# Altium schematic sheet Sweep.SchDoc
size A4
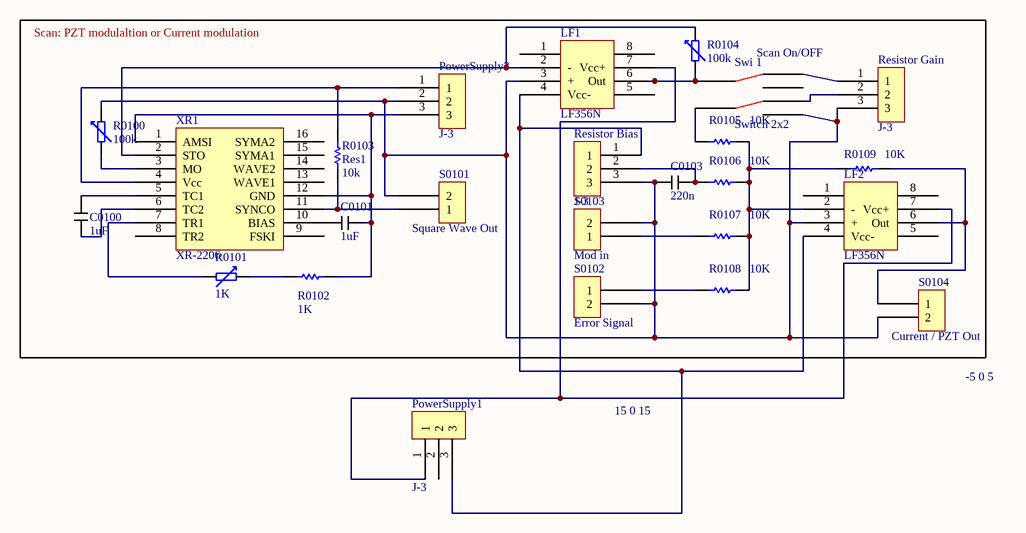
[diagram p0: Sweep.SchDoc]

## Parts
C0100  1uF  [Capacitor]
C0101  1uF  [Capacitor]
C0103  220n  [Capacitor]
LF1  LF356N  [DIP8]
LF2  LF356N  [DIP8]
PowerSupply1  J-3  [J3]
PowerSupply3  J-3  [J3]
R0100  100k  [J3]
R0101  1K  [J3]
R0102  value 1K  [AXIAL-0.3]  (hidden comment: Res1)
R0103  Res1  value 10k  [AXIAL-0.3]
R0104  100k  [J3]
R0105  value 10K  [AXIAL-0.3]  (hidden comment: Res1)
R0106  value 10K  [AXIAL-0.3]  (hidden comment: Res1)
R0107  value 10K  [AXIAL-0.3]  (hidden comment: Res1)
R0108  value 10K  [AXIAL-0.3]  (hidden comment: Res1)
R0109  value 10K  [AXIAL-0.3]  (hidden comment: Res1)
Resistor_Bias  J-3  [J3]
Resistor_Gain  J-3  [J3]
S0101  Square Wave Out  [SMA-S]
S0102  Error Signal  [SMA-S]
S0103  Mod in  [SMA-S]
S0104  Current / PZT Out  [SMA-S]
Swi_1  Switch 2x2  [Swi 2x2]
XR1  XR-2206  [DIP16]

## Nets
NetC0100_1: C0100.1 XR1.5(TC1)
NetC0100_2: C0100.2 XR1.6(TC2)
NetC0101_1: C0101.1 XR1.10(BIAS)
NetC0101_2: C0101.2 PowerSupply3.3 R0102.2 XR1.1(AMSI) XR1.12(GND)
NetC0103_1: C0103.1 LF1.3(+) LF2.3(+) PowerSupply3.2 R0100.2 Resistor_Bias.3 Resistor_Gain.3 S0101.2 S0102.2 S0103.2 S0104.2 Swi_1.6
NetC0103_2: C0103.2 R0106.1 Resistor_Bias.2
NetLF1_2: LF1.2(-) R0104.2 XR1.2(STO)
NetLF1_4: LF1.4(Vcc-) LF2.4(Vcc-) PowerSupply1.3 Resistor_Bias.1
NetLF1_6: LF1.6(Out) R0104.1 Swi_1.1
NetLF1_7: LF1.7(Vcc+) LF2.7(Vcc+) PowerSupply1.1
NetLF2_2: LF2.2(-) R0105.2 R0106.2 R0107.2 R0108.2 R0109.1
NetLF2_6: LF2.6(Out) R0109.2 S0104.1
NetPowerSupply3_1: PowerSupply3.1 R0103.2 XR1.4(Vcc)
NetR0100_1: R0100.1 XR1.3(MO)
NetR0101_1: R0101.1 XR1.7(TR1)
NetR0101_2: R0101.2 R0102.1
NetR0103_1: R0103.1 S0101.1 XR1.11(SYNCO)
NetR0105_1: R0105.1 Swi_1.2
NetR0107_1: R0107.1 S0103.1
NetR0108_1: R0108.1 S0102.1
NetResistor_Gain_1: Resistor_Gain.1 Swi_1.3
NetResistor_Gain_2: Resistor_Gain.2 Swi_1.4

Not connected (* = marked no-connect by the designer): LF1 1(Offset_Null) 5(Offset_Null2) 8(N.C.); LF2 1(Offset_Null) 5(Offset_Null2) 8(N.C.); PowerSupply1 2; Swi_1 5; XR1 8(TR2) 9(FSKI) 13(WAVE1) 14(WAVE2) 15(SYMA1) 16(SYMA2)

## Notes on the sheet
- Scan: PZT modulaltion or Current modulation
- (near Swi_1) Scan On/OFF
- 15 0 15
- -5 0 5

## Library data of the parts
C0100 C0101 C0103 = Cap
R0100 R0101 R0104 = Res Adj
R0102 R0103 R0105 R0106 R0107 R0108 R0109 = Res1: Resistor; Published: 8-Jun-2000; LatestRevisionDate: 17-Jul-2002; LatestRevisionNote: Re-released for DXP Platform.; PackageReference: AXIAL-0.3; Publisher: Altium Limited; PackageDescription: Axial Device, Thru-Hole; 2 Leads; 0.3 in Pin Spacing
S0101 S0102 S0103 S0104 = SMA-S